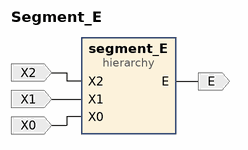
[diagram p0: block diagram of the top level]
# Vivado block design Segment_E, xc7a35tcpg236-1, Vivado 2018.3
create_bd_design Segment_E

create_bd_port -dir I X2
create_bd_port -dir I X1
create_bd_port -dir I X0
create_bd_port -dir O E

create_bd_cell -type hier segment_E

# ---- hierarchy /segment_E ----
current_bd_instance /segment_E
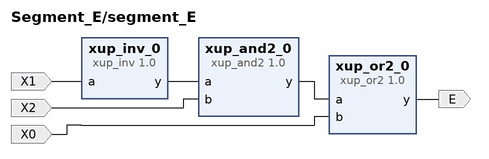
[diagram p1: block diagram inside /segment_E]
create_bd_pin -dir I X1
create_bd_pin -dir I X2
create_bd_pin -dir I X0
create_bd_pin -dir O E

create_bd_cell -type ip -vlnv xilinx.com:xup:xup_inv:1.0 xup_inv_0
set_property -dict {CONFIG.DELAY 0} [get_bd_cells xup_inv_0]
create_bd_cell -type ip -vlnv xilinx.com:xup:xup_and2:1.0 xup_and2_0
set_property -dict {CONFIG.DELAY 0} [get_bd_cells xup_and2_0]
create_bd_cell -type ip -vlnv xilinx.com:xup:xup_or2:1.0 xup_or2_0
set_property -dict {CONFIG.DELAY 0} [get_bd_cells xup_or2_0]

# ---- connections ----

current_bd_instance /segment_E
connect_bd_net [get_bd_pins xup_inv_0/y] [get_bd_pins xup_and2_0/a]
connect_bd_net [get_bd_pins xup_and2_0/y] [get_bd_pins xup_or2_0/a]
connect_bd_net -net a_0_1 [get_bd_pins X1] [get_bd_pins xup_inv_0/a]
connect_bd_net -net b_0_1 [get_bd_pins X2] [get_bd_pins xup_and2_0/b]
connect_bd_net -net b_1_1 [get_bd_pins X0] [get_bd_pins xup_or2_0/b]
connect_bd_net [get_bd_pins xup_or2_0/y] [get_bd_pins E]

current_bd_instance /
connect_bd_net -net b_0_1 [get_bd_ports X2] [get_bd_pins segment_E/X2]
connect_bd_net -net a_0_1 [get_bd_ports X1] [get_bd_pins segment_E/X1]
connect_bd_net -net b_1_1 [get_bd_ports X0] [get_bd_pins segment_E/X0]
connect_bd_net -net xup_or2_0_y [get_bd_pins segment_E/E] [get_bd_ports E]

validate_bd_design
save_bd_design
